# Altium schematic sheet USB.SchDoc
size A4
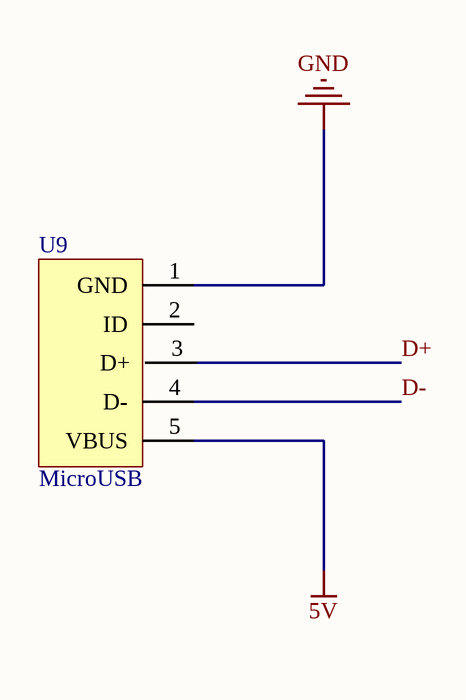
[diagram p0: USB.SchDoc]

## Parts
U9  MicroUSB  [Micro-USB]

## Nets
5V: U9.5(VBUS)
GND: U9.1(GND)
D+: U9.3(D+)
D-: U9.4(D-)

Not connected (* = marked no-connect by the designer): U9 2(ID)

## Library data of the parts
U9 = MicroUSB_B